# Altium schematic sheet Controle de luminosidade com ESP32.SchDoc
size A4; DocumentNumber: 6; SheetNumber: 6; SheetTotal: 6
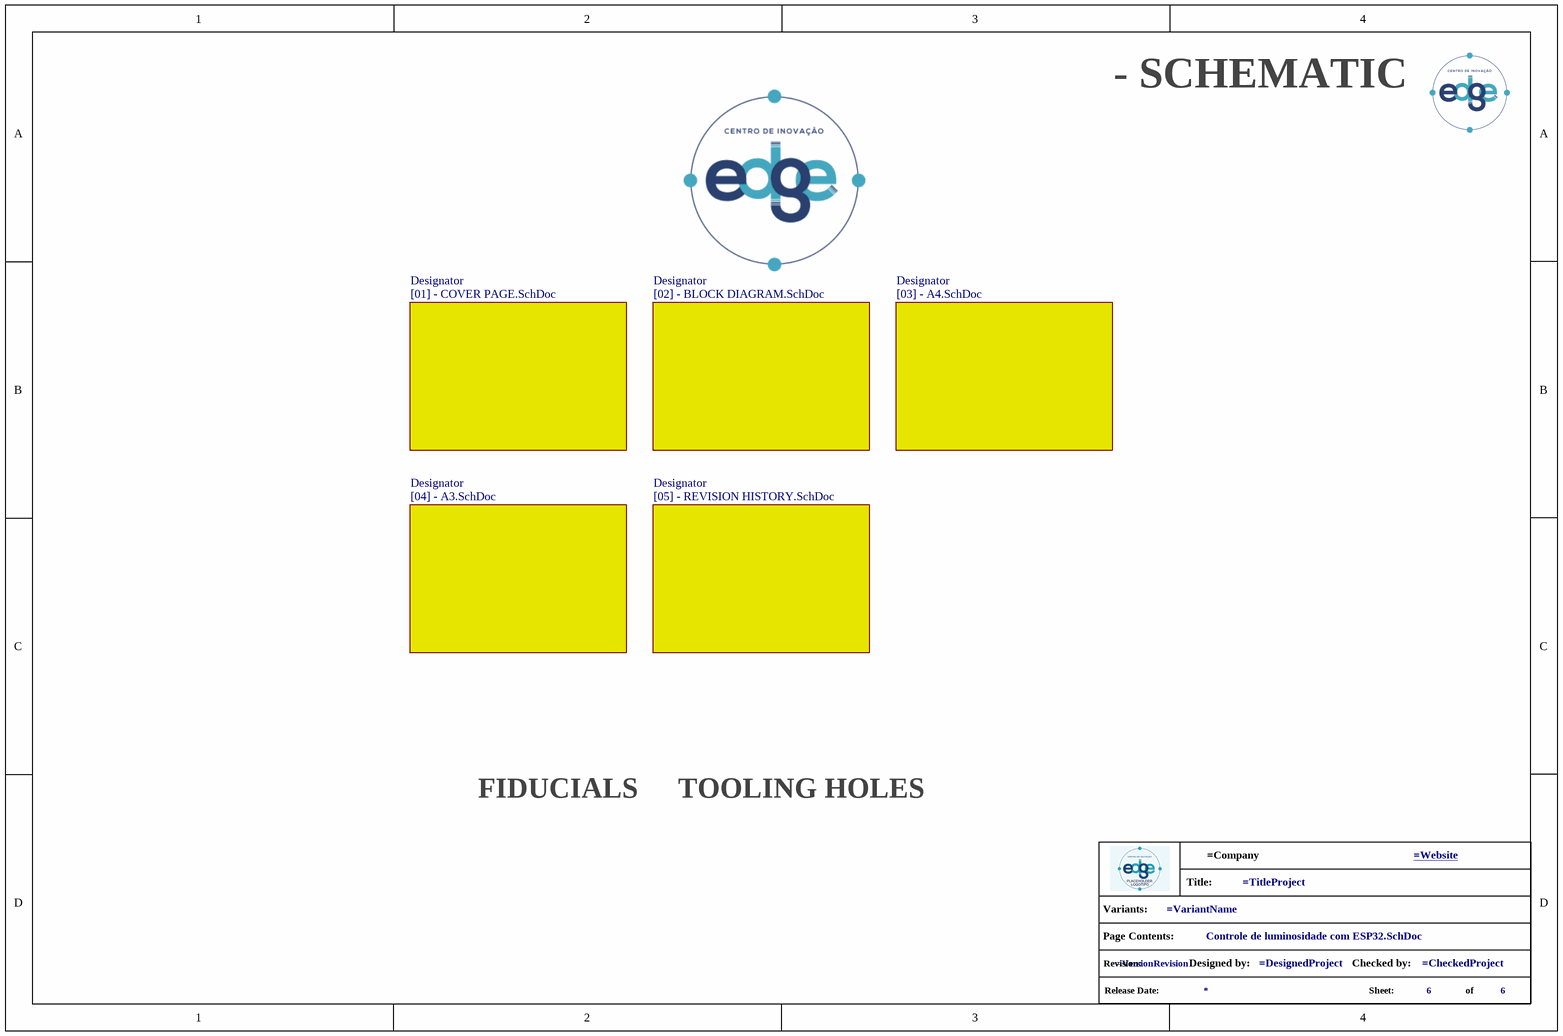
[diagram p0: Controle de luminosidade com ESP32.SchDoc]

## Parts
*?  info_project  (value not drawn)  (graphical)

## Sub-sheets
Designator = [02] - BLOCK DIAGRAM.SchDoc: no entries
Designator = [03] - A4.SchDoc: no entries
Designator = [01] - COVER PAGE.SchDoc: no entries
Designator = [04] - A3.SchDoc: no entries
Designator = [05] - REVISION HISTORY.SchDoc: no entries

## Notes on the sheet
- - SCHEMATIC
- FIDUCIALS
- TOOLING HOLES
- (in symbol info_project) Title:; Variants:; Page Contents:; Revision:; Designed by:; Checked by:; Release Date:; Sheet:; of